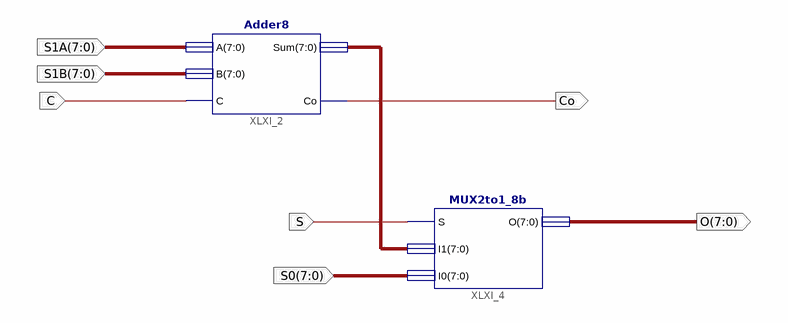
[diagram p0: schematic sheet 1]
// Xilinx ISE schematic ScoreUp.sch (kintex7) as structural Verilog: 2 symbols, 7 ports
module ScoreUp (
  input  [7:0] S1A,
  input  [7:0] S1B,
  input  C,
  input  S,
  input  [7:0] S0,
  output Co,
  output [7:0] O
);

  wire [7:0] XLXN_1;

  Adder8 XLXI_2 (.A(S1A), .B(S1B), .C(C), .Sum(XLXN_1), .Co(Co));
  MUX2to1_8b XLXI_4 (.S(S), .I1(XLXN_1), .I0(S0), .O(O));
endmodule
